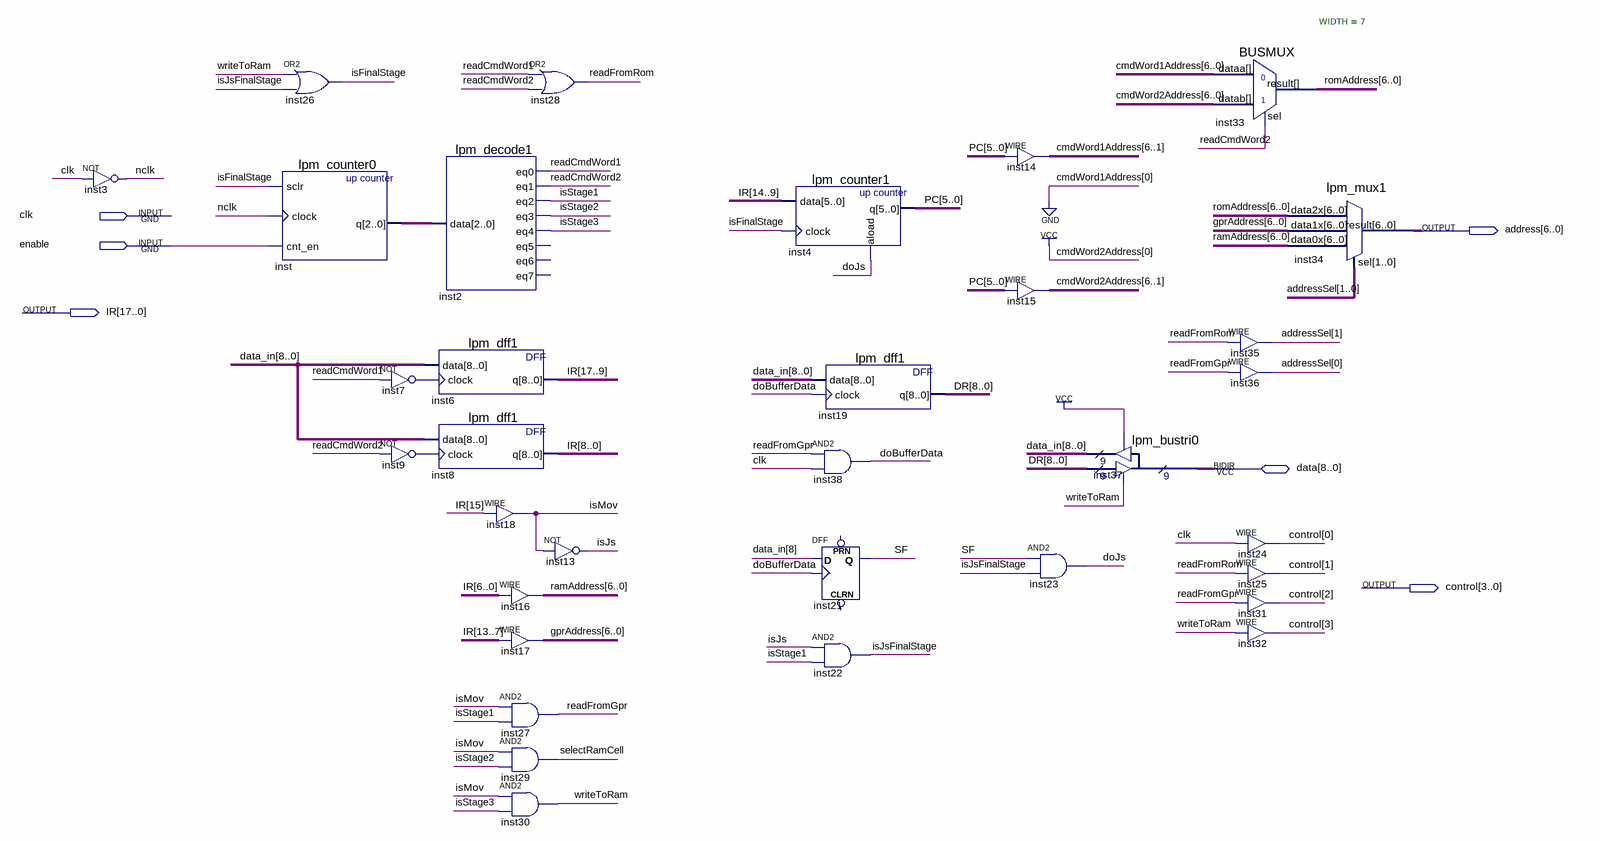
[diagram p0: schematic sheet]
// Quartus schematic CU.bdf as structural Verilog: 33 symbols, 6 pins
module CU (
  input  clk,
  input  enable,
  inout  [8:0] data,
  output [6:0] address,
  output [17:0] IR,
  output [3:0] control
);

  wire doBufferData, doJs, inst7_out, inst9_out, isFinalStage, isJs, isJsFinalStage, isMov, isStage1,
       isStage2, isStage3, nclk, readCmdWord1, readCmdWord2, readFromGpr, readFromRom, selectRamCell, SF,
       writeToRam;
  wire [1:0] addressSel;
  wire [2:0] inst_q;
  wire [5:0] PC;
  wire [6:0] gprAddress, ramAddress, romAddress;
  wire [6:1] cmdWord1Address, cmdWord2Address;
  wire [8:0] data_in, DR;

  not inst3 (nclk, clk);
  or inst26 (isFinalStage, writeToRam, isJsFinalStage);
  lpm_counter0 inst (.sclr(isFinalStage), .clock(nclk), .cnt_en(enable), .q(inst_q));
  not inst7 (inst7_out, readCmdWord1);
  not inst9 (inst9_out, readCmdWord2);
  lpm_decode1 inst2 (
    .data(inst_q), .eq0(readCmdWord1), .eq1(readCmdWord2), .eq2(isStage1), .eq3(isStage2), .eq4(isStage3));  // open: eq5, eq6, eq7
  lpm_dff1 inst6 (.data(data_in), .clock(inst7_out), .q(IR[17:9]));
  lpm_dff1 inst8 (.data(data_in), .clock(inst9_out), .q(IR[8:0]));
  or inst28 (readFromRom, readCmdWord1, readCmdWord2);
  assign isMov = IR[15];  // WIRE inst18
  assign ramAddress = IR[6:0];  // WIRE inst16
  assign gprAddress = IR[13:7];  // WIRE inst17
  and inst27 (readFromGpr, isMov, isStage1);
  and inst29 (selectRamCell, isMov, isStage2);
  and inst30 (writeToRam, isMov, isStage3);
  not inst13 (isJs, isMov);
  lpm_counter1 inst4 (.data(IR[14:9]), .clock(isFinalStage), .aload(doJs), .q(PC));
  lpm_dff1 inst19 (.data(data_in), .clock(doBufferData), .q(DR));
  and inst38 (doBufferData, readFromGpr, clk);
  DFF inst21 (.CLK(doBufferData), .D(data_in[8]), .Q(SF));  // open: CLRN, PRN
  and inst22 (isJsFinalStage, isJs, isStage1);
  assign cmdWord1Address = PC;  // WIRE inst14
  assign cmdWord2Address = PC;  // WIRE inst15
  and inst23 (doJs, SF, isJsFinalStage);
  lpm_bustri0 inst37 (.enabledt(writeToRam), .data(DR), .enabletr(1'b1), .result(data_in), .tridata(data));
  BUSMUX #(.WIDTH(7)) inst33 (
    .datab({cmdWord2Address, 1'b1}), .sel(readCmdWord2), .dataa({cmdWord1Address, 1'b0}), .result(romAddress));
  assign addressSel[1] = readFromRom;  // WIRE inst35
  assign addressSel[0] = readFromGpr;  // WIRE inst36
  assign control[0] = clk;  // WIRE inst24
  assign control[1] = readFromRom;  // WIRE inst25
  assign control[2] = readFromGpr;  // WIRE inst31
  assign control[3] = writeToRam;  // WIRE inst32
  lpm_mux1 inst34 (.data2x(romAddress), .data1x(gprAddress), .data0x(ramAddress), .sel(addressSel), .result(address));
endmodule
